# EAGLE design H0FR7 (EAGLE 9.6.1)

## Sheet 1 of 2
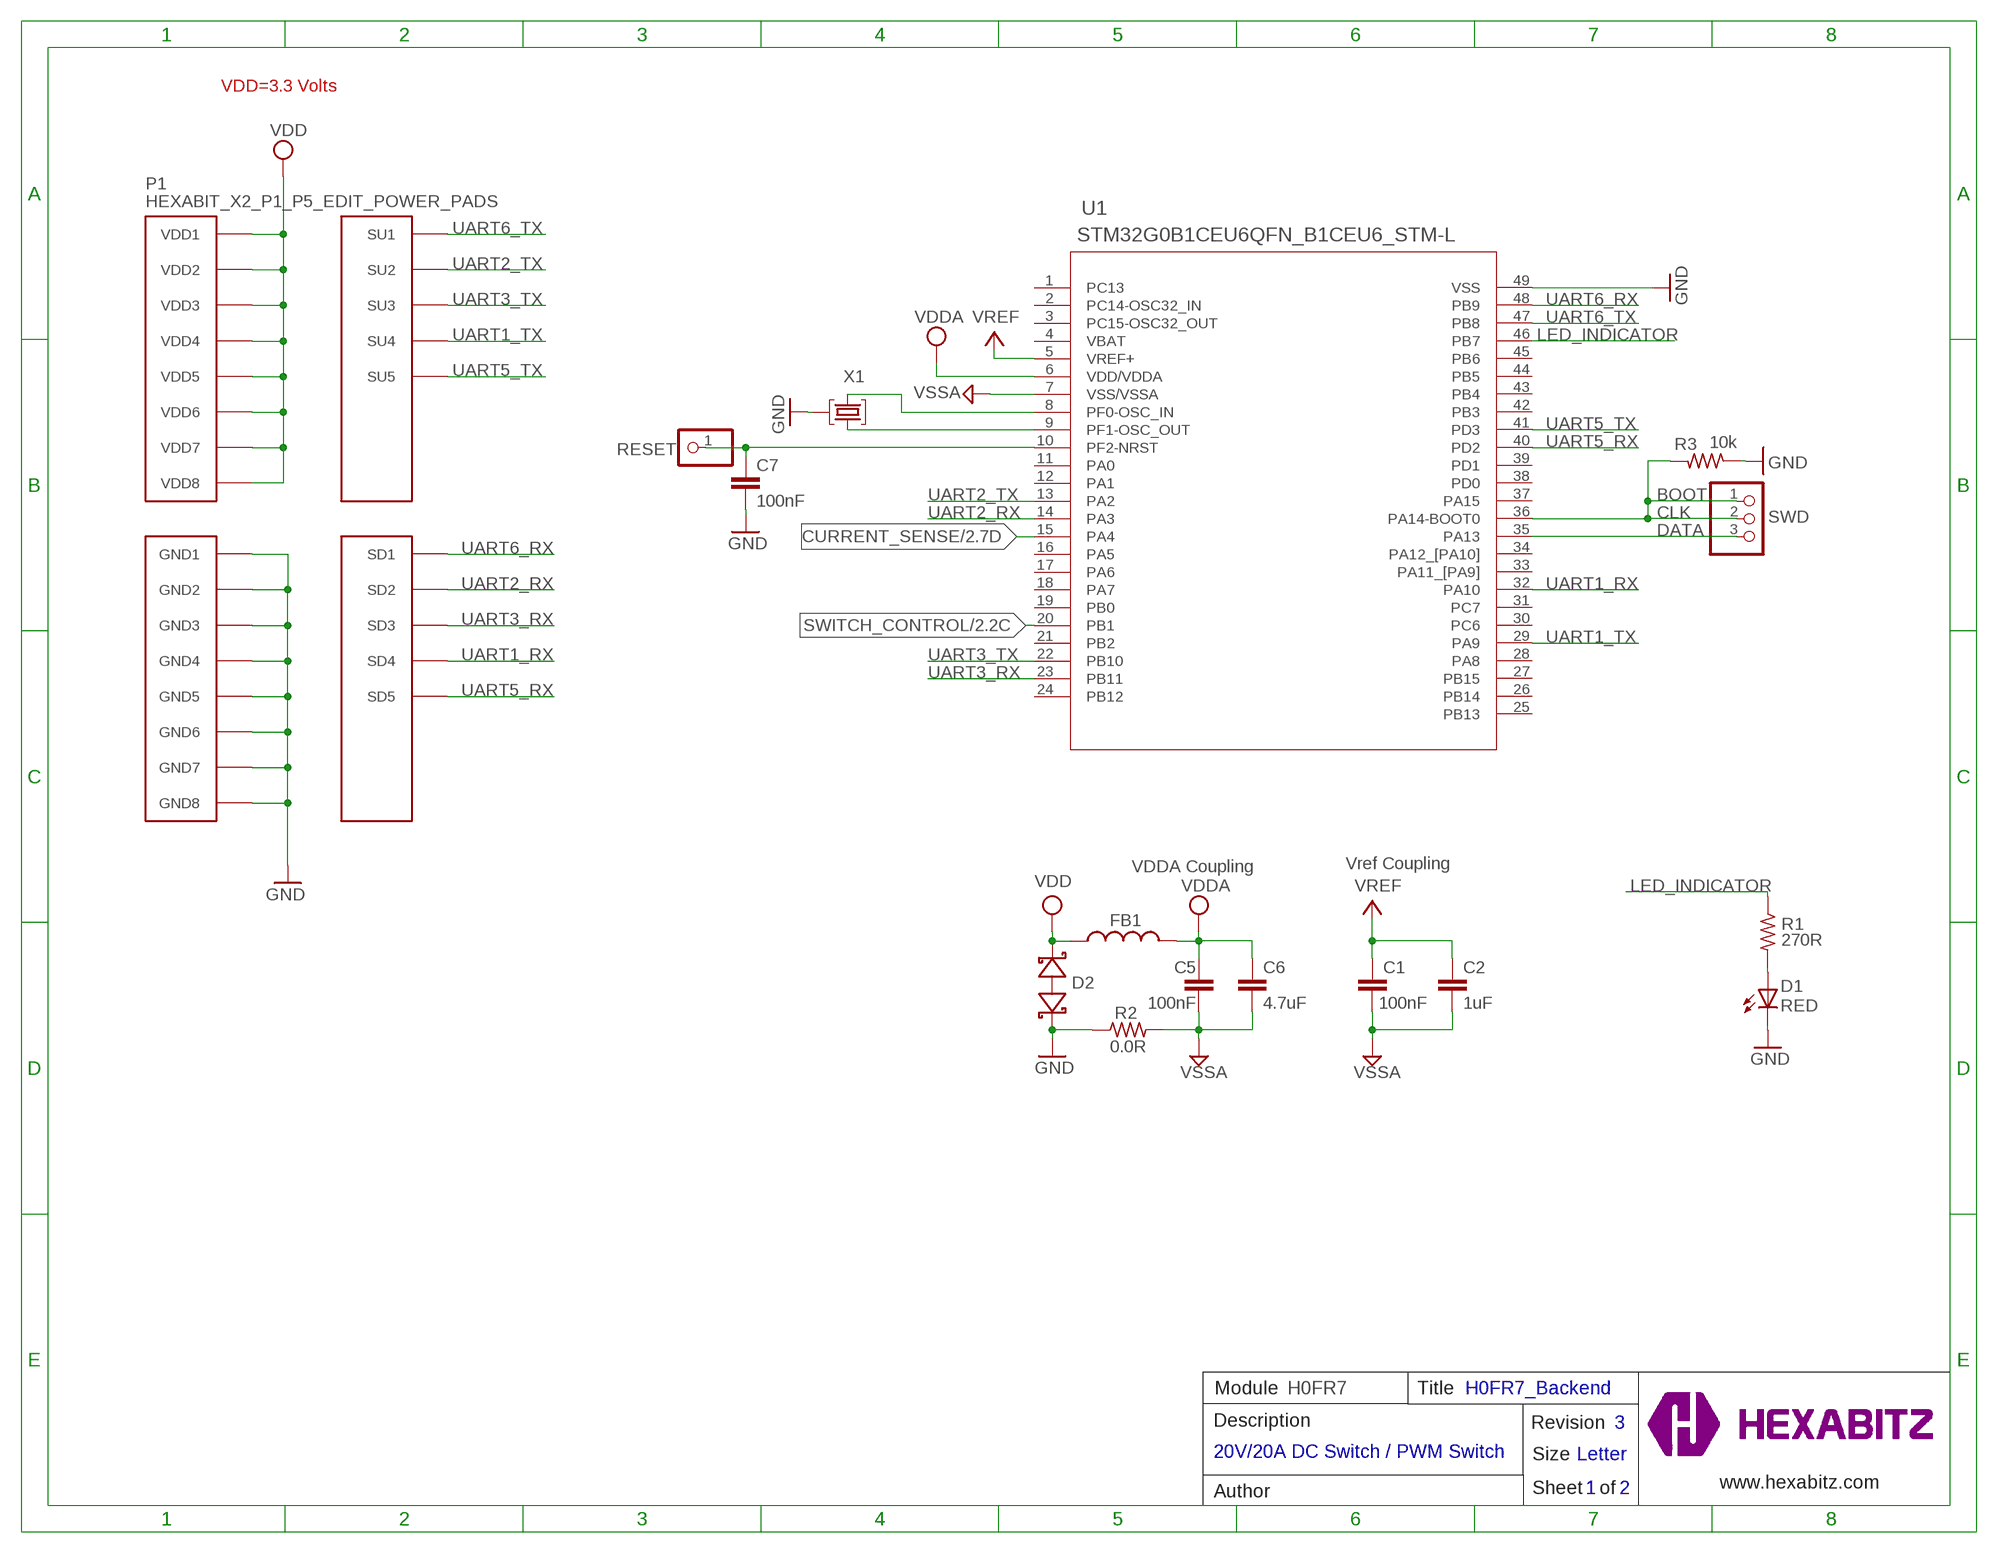
[diagram p0: schematic, sheet 1]

### Parts
C1  100nF  C-0603  [C-0603]
C2  1uF  C-0805  [C-0805]
C5  100nF  C-0603  [C-0603]
C6  4.7uF  C-0805  [C-0805]
C7  100nF  C-0603  [C-0603]
D1  RED  VLMS1300-GS08  [VLMS1300-GS08]
D2  BOURNS_CDSOD323-T03SCBOURNS_CDSOD323-T03SC_0_0  [BOURNS_CDSOD323-T03SC_0]
FB1  FB-0603  [FB-0603]
P1  HEXABIT_X2_P1_P5_EDIT_POWER_PADS  [HEXABIT_X2_P1_P5_EDIT_POWER_PADS]
R1  270R  R-0603  [R-0603]
R2  0.0R  R-0603  [R-0603]
R3  10k  R-0603  [R-0603]
RESET  R  PINHD-1X1  [1X01]
SWD  PINHD-1X3SWD  [SWD]
TRIMBLE-LOGO2  HEXA-LOGO  [HEXA-LOGO]
U1  STM32G0B1CEU6QFN_B1CEU6_STM-L  [QFN_B1CEU6_STM-L]
X1  XTALL_CSTCE8M00G52  [XTALL_CSTCE8M00G52]

### Nets
CLK: R3.2 SWD.1 SWD.2 U1.36(PA14-BOOT0)
CURRENT_SENSE: U1.15(PA4) ; also sheet 2
DATA: SWD.3 U1.35(PA13)
GND: C7.2 D1.C D2.2(C) P1.PAD_PD11(GND1) P1.PAD_PD12(GND2) P1.PAD_PD13(GND3) P1.PAD_PD14(GND4) P1.PAD_PD17(GND5) P1.PAD_PD18(GND6) P1.PAD_PD19(GND7) P1.PAD_PD20(GND8) R2.1 R3.1 U1.49(VSS) X1.P$2
LED_INDICATOR: R1.1 U1.46(PB7)
N$1: U1.9(PF1-OSC_OUT) X1.P$3
N$2: U1.8(PF0-OSC_IN) X1.P$1
N$4: D1.A R1.2
N$5: C7.1 RESET.1 U1.10(PF2-NRST)
SWITCH_CONTROL: U1.20(PB1) ; also sheet 2
UART1_RX: P1.PAD_PD4(SD4) U1.32(PA10)
UART1_TX: P1.PAD_PU4(SU4) U1.29(PA9)
UART2_RX: P1.PAD_PD2(SD2) U1.14(PA3)
UART2_TX: P1.PAD_PU2(SU2) U1.13(PA2)
UART3_RX: P1.PAD_PD3(SD3) U1.23(PB11)
UART3_TX: P1.PAD_PU3(SU3) U1.22(PB10)
UART5_RX: P1.PAD_PD5(SD5) U1.40(PD2)
UART5_TX: P1.PAD_PU5(SU5) U1.41(PD3)
UART6_RX: P1.PAD_PD1(SD1) U1.48(PB9)
UART6_TX: P1.PAD_PU1(SU1) U1.47(PB8)
VDD: D2.1(A) FB1.1 P1.PAD_PU11(VDD1) P1.PAD_PU12(VDD2) P1.PAD_PU13(VDD3) P1.PAD_PU14(VDD4) P1.PAD_PU17(VDD5) P1.PAD_PU18(VDD6) P1.PAD_PU19(VDD7) P1.PAD_PU20(VDD8)
VDDA: C5.1 C6.1 FB1.2 U1.6(VDD/VDDA) ; also sheet 2
VREF: C1.1 C2.1 U1.5(VREF+)
VSSA: C1.2 C2.2 C5.2 C6.2 R2.2 U1.7(VSS/VSSA) ; also sheet 2
Unconnected: U1.1(PC13) U1.2(PC14-OSC32_IN) U1.3(PC15-OSC32_OUT) U1.4(VBAT) U1.11(PA0) U1.12(PA1) U1.16(PA5) U1.17(PA6) U1.18(PA7) U1.19(PB0) U1.21(PB2) U1.24(PB12) U1.25(PB13) U1.26(PB14) U1.27(PB15) U1.28(PA8) U1.30(PC6) U1.31(PC7) U1.33(PA11_[PA9]) U1.34(PA12_[PA10]) U1.37(PA15) U1.38(PD0) U1.39(PD1) U1.42(PB3) U1.43(PB4) U1.44(PB5) U1.45(PB6)

### Notes on the sheet
- VDD=3.3 Volts
- BOOT
- VDDA Coupling | Vref Coupling
- Module | H0FR7 | Title | H0FR7_Backend
- Description | Revision | 3
- 20V/20A DC Switch / PWM Switch | Size | Letter
- www.hexabitz.com
- Author | Sheet   of | 1 | 2
- C:/Users/Admin/Desktop/logodraft.bmp

## Sheet 2 of 2
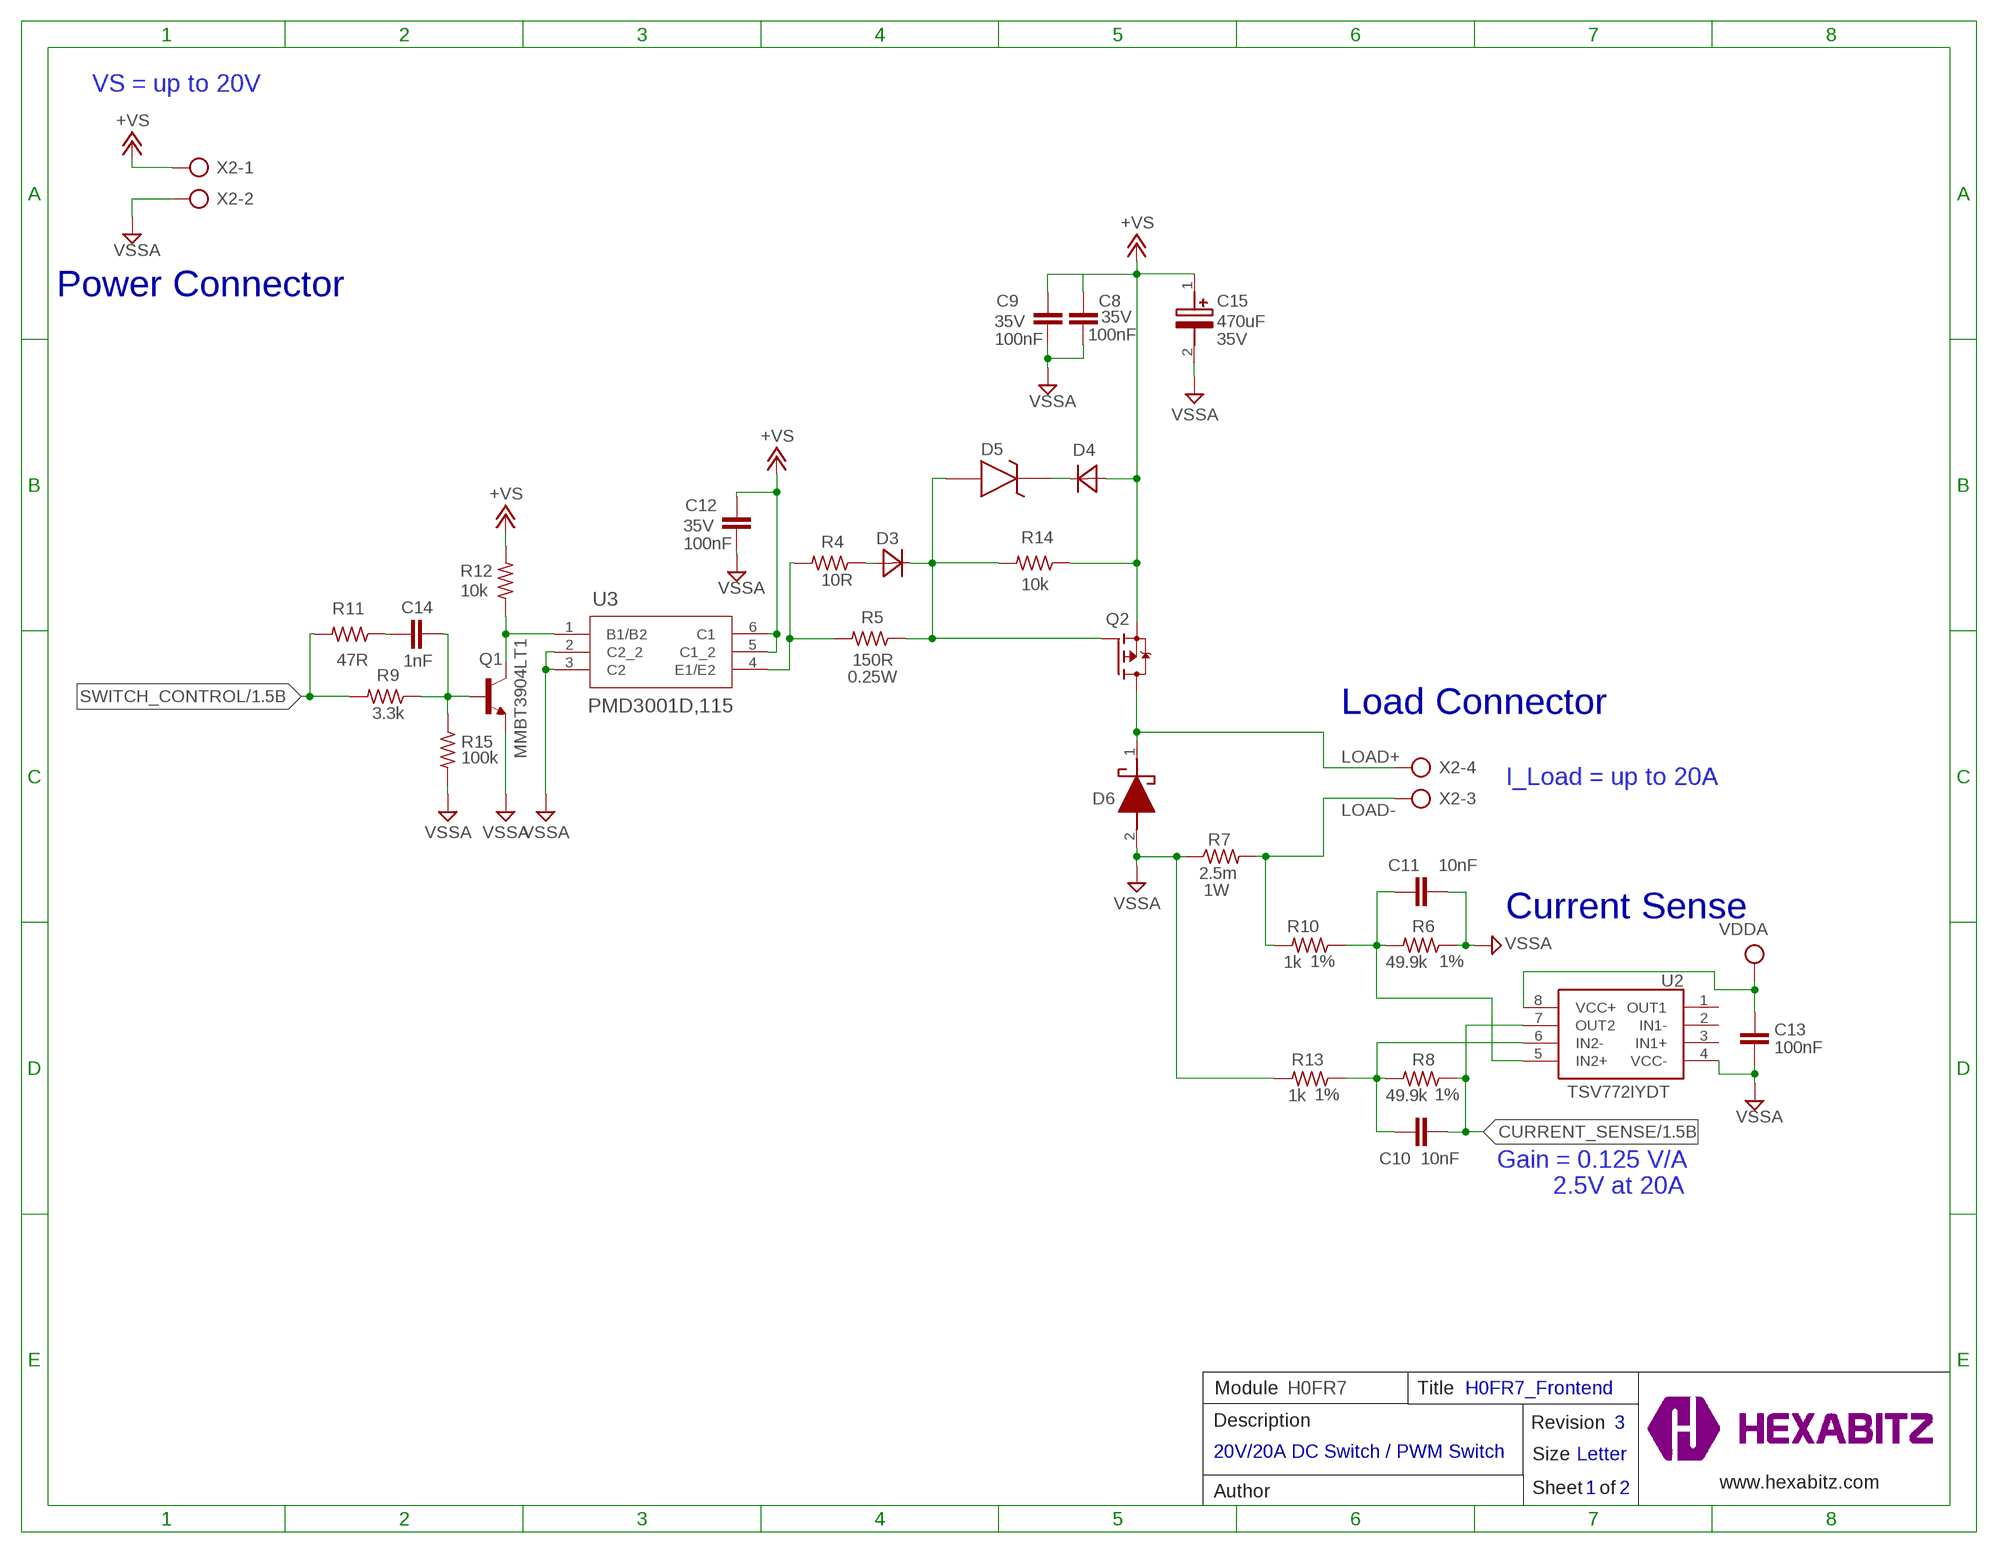
[diagram p1: schematic, sheet 2]

### Parts
C8  C-0603  [C-0603]
C9  C-0603  [C-0603]
C10  10nF  C-0603  [C-0603]
C11  10nF  C-0603  [C-0603]
C12  C-0603  [C-0603]
C13  100nF  C-0603  [C-0603]
C14  1nF  C-0603  [C-0603]
C15  ESH477M035AH3AA  [CAPPRD500W60D1000H1700]
D3  DIOD-SOD-123  [SOD123]
D4  DIOD-SOD-123  [SOD123]
D5  MMSZ4705T1GMMSZ4705T1G  [DIO_MMSZ4700T1G]
D6  V8PAM10S-M3_H  [V8PAM10SHM3H]
Q1  MMBT3904LT1  [MMBT3904LT1]
Q2  STD36P4LLF6  [DPAK-3]
R4  10R  R-0603  [R-0603]
R5  150R  R-0603  [R-0603]
R6  49.9k  R-0603  [R-0603]
R7  2.5m  R_1206R1206  [R1206]
R8  49.9k  R-0603  [R-0603]
R9  3.3k  R-0603  [R-0603]
R10  1k  R-0603  [R-0603]
R11  47R  R-0603  [R-0603]
R12  10k  R-0603  [R-0603]
R13  1k  R-0603  [R-0603]
R14  10k  R-0603  [R-0603]
R15  100k  R-0603  [R-0603]
U2  TSV772IYDT  [SOIC127P600X175-8N]
U3  PMD3001D,115  PMD3001DSOT457_NEX  [SOT457_NEX]
X2  AK300/4  [AK300/4]

### Nets
+VS: C8.2 C9.2 C12.2 C15.1(+) D4.1(A) Q2.3(S) R12.2 R14.1 U3.5(C1_2) U3.6(C1) X2.1
CURRENT_SENSE: C10.2 R8.1 U2.7(OUT2) ; also sheet 1
LOAD+: D6.1(K) Q2.4(D) X2.4
LOAD-: R7.2 R10.2 X2.3
N$3: Q1.3(C) R12.1 U3.1(B1/B2)
N$6: C11.1 R6.2 R10.1 U2.5(IN2+)
N$8: D4.2(C) D5.K
N$9: C10.1 R8.2 R13.1 U2.6(IN2-)
N$13: D3.1(A) R4.1
N$14: C14.2 Q1.1(B) R9.1 R15.1
N$15: C14.1 R11.1
N$16: R4.2 R5.2 U3.4(E1/E2)
N$19: D3.2(C) D5.A Q2.1(G) R5.1 R14.2
SWITCH_CONTROL: R9.2 R11.2 ; also sheet 1
VDDA: C13.2 U2.8(VCC+) ; also sheet 1
VSSA: C8.1 C9.1 C11.2 C12.1 C13.1 C15.2(-) D6.2(A) Q1.2(E) R6.1 R7.1 R13.2 R15.2 U2.4(VCC-) U3.2(C2_2) U3.3(C2) X2.2 ; also sheet 1
Unconnected: U2.1(OUT1) U2.2(IN1-) U2.3(IN1+)

### Notes on the sheet
- VS = up to 20V
- Power Connector
- Load Connector
- I_Load = up to 20A
- Current Sense
- Gain = 0.125 V/A
          2.5V at 20A
- Module | H0FR7 | Title | H0FR7_Frontend
- Description | Revision | 3
- 20V/20A DC Switch / PWM Switch | Size | Letter
- www.hexabitz.com
- Author | Sheet   of | 1 | 2

## Library data of the parts
C1 C7 C14 = HEXABITZ_RCLS:C-0603: CAP CER 10% X7R 0603; CAPACITANCE: 100nF; MFN: KEMET; MPN: C0603C104K8RACTU; OCTOPART_URL: https://octopart.com/c0603c104k8ractu-kemet-145075?r=sp&s=9bS9ASSwSEqMCE9KBEQZ0g; TOLERANCE: 10%; VOLTAGE_RATING: 10V
C2 C6 = HEXABITZ_RCLS:C-0805: CAP CER 10% X7R 0805
C5 = HEXABITZ_RCLS:C-0603: CAP CER 10% X7R 0603
C8 C9 C12 = HEXABITZ_RCLS:C-0603: CAP CER 10% X7R 0603; CAPACITANCE: 100nF; VOLTAGE_RATING: 35V
C10 C11 C13 = HEXABITZ_RCLS:C-0603: CAP CER 10% X7R 0603; CAPACITANCE: 100nF; MFN: KEMET; MPN: C0603C104K8RACTU; OCTOPART_URL: https://octopart.com/c0603c104k8ractu-kemet-145075?r=sp&s=9bS9ASSwSEqMCE9KBEQZ0g; TOLERANCE: 10V; VOLTAGE_RATING: 10%
C15 = HEXABITZ_RCLS:ESH477M035AH3AA: Kemet 470uF Electrolytic Aluminium Electrolytic Capacitor 35V dc Through Hole - ESH477M035AH3AA Source: Datasheet <https://www.arrow.com/en/products/esh477m035ah3aa/kemet-corporation>; CAPACITANCE: 470uF; DESCRIPTION: Kemet 470uF Electrolytic Aluminium Electrolytic Capacitor 35V dc Through Hole - ESH477M035AH3AA; HEIGHT: 17mm; MANUFACTURER_NAME: KEMET; MANUFACTURER_PART_NUMBER: ESH477M035AH3AA; MOUSER_PART_NUMBER: 80-ESH477M035AH3AA; MOUSER_PRICE-STOCK: https://www.mouser.co.uk/ProductDetail/KEMET/ESH477M035AH3AA?qs=w9hhVRgtvfm6jijrpCvP%2Fg%3D%3D; VOLT_RATING: 35V
D1 = Hexabitz:VLMS1300-GS08: Red 0603 130° Clear 54 mcd 2 V Surface Mount ChipLED ; Octopart Url : http://octopart.com/vlms1300-gs08-vishay-21709201; MFN: Vishay; MPN: VLMS1300-GS08; OCTOPART_URL: https://octopart.com/vlms1300-gs08-vishay-21709201?r=sp&s=_gcP4_q8T1SC6PJQPTQ9yA
D2 = HEXABITZ_RCLS:BOURNS_CDSOD323-T03SC: CDSOD323-TxxSC - TVS Diode Series; DESCRIPTION: Dio Tvs Vwm 03V 500W Bidir Sod323 / Tape & Reel - 7" Reel; MFN: Bourns; MPN: CDSOD323-T03SC; OCTOPART_URL: https://octopart.com/cdsod323-t03sc-bourns-10487153?r=sp
D3 D4 = HEXABITZ_RCLS:DIOD-SOD-123: 1.0 A Surface Mount Schottky Barrier Rectifier, 40 V, -65 to 125 degC, 2-Pin SOD-123 Package, RoHS, Tape and Reel; MPN: 1N4148W-7-F
D5 = HEXABITZ_RCLS:MMSZ4705T1G: 18 V Low Current ZenerDiodeVoltage Regulator Source: Datasheet <http://www.onsemi.com/pub/Collateral/MMSZ4678T1-D.PDF>; MPN: MMSZ4678T1G; VOLTAGE: 18V; WATT: 0.5w
D6 = HEXABITZ_RCLS:V8PAM10S-M3_H: Schottky Diodes & Rectifiers 8A 100V Source: Datasheet <https://www.vishay.com/docs/87013/v8pam10s.pdf>; DESCRIPTION: Schottky Diodes & Rectifiers 8A 100V; HEIGHT: 1mm; MANUFACTURER_NAME: Vishay; MANUFACTURER_PART_NUMBER: V8PAM10S-M3/H; MOUSER_PART_NUMBER: 78-V8PAM10S-M3/H; MOUSER_PRICE-STOCK: https://www.mouser.co.uk/ProductDetail/Vishay-General-Semiconductor/V8PAM10S-M3-H?qs=7MVldsJ5Uazp%2FkF6tV7Ktw%3D%3D
FB1 = HEXABITZ_RCLS:FB-0603: Ferrite Beads Multi-Layer 0603
P1 = hexabitz_connectors:HEXABIT_X2_P1_P5_EDIT_POWER_PADS
Q1 = HEXABITZ_RCLS:MMBT3904LT1: TRANS NPN 40V 0.2A SOT23; MOUNTING_STYLE: Surface Mount; NUM_OF_PINS: 3; PACKAGE: SOT-23-3; PACKAGING: Reel; PRODUCT_CATEGORY: Transistors Bipolar-BJT; SERIES: MMBT3904L
Q2 = HEXABITZ_RCLS:STD36P4LLF6: P-channel 40 V, 0.0175 Ω typ.,36 A, STripFET™ F6 Power MOSFET in a DPAK package; DISCRIPTION: P-channel 40 V, 0.0175 Ohm typ., 36 A STripFET F6 in a DPAK package; MFN: STMicroelectronics; MPN: STD36P4LLF6; OCTOPART_URL: https://octopart.com/std36p4llf6-stmicroelectronics-34425371?r=sp
R1 R2 = HEXABITZ_RCLS:R-0603: Thick Film Resistors - SMD 0603
R3 R12 = HEXABITZ_RCLS:R-0603: Thick Film Resistors - SMD 0603; MFN: Yageo; MPN: RC0603JR-0710KL; OCTOPART_URL: https://octopart.com/search?q=RC0603JR-0710KL&start=0; RESISTANCE: 10.0K Ohm; TOLERANCE: 5%
R4 R9 R11 R14 R15 = HEXABITZ_RCLS:R-0603: Thick Film Resistors - SMD 0603; MFN: Yageo; MPN: RC0603JR-07680KL; OCTOPART_URL: https://octopart.com/rc0603jr-07680kl-yageo-40953169?r=sp; RESISTANCE: 680K Ohm; TOLERANCE: 5%
R5 = HEXABITZ_RCLS:R-0603: Thick Film Resistors - SMD 0603; MPN: CRGP0603F150R; POWER: 0.25W
R6 R8 R10 R13 = HEXABITZ_RCLS:R-0603: Thick Film Resistors - SMD 0603; MFN: Yageo; MPN: RC0603JR-071KL; OCTOPART_URL: https://octopart.com/rc0603jr-071kl-yageo-55402888?r=sp; RESISTANCE: 1k; TOLERANCE: 1%
R7 = HEXABITZ_RCLS:R_1206: RESISTOR, American symbol; MFN: Stackpole Electronics; MPN: PA1206FRE472U5Z; POWER: 1W
RESET = HEXABITZ_USER_INTERFACE_PARTS:PINHD-1X1: PIN HEADER; MFN: TE Connectivity; MPN: 87227-1; OCTOPART_URL: https://octopart.com/87227-1-te+connectivity-39512052?r=sp
SWD = HEXABITZ_CONNECTION_PARTS:PINHD-1X3: PIN HEADER
TRIMBLE-LOGO2 = HEXABITZ_USER_INTERFACE_PARTS:HEXA-LOGO: Trimble-Logo
U1 = HEXABITZ_ICs:STM32G0B1CEU6; COPYRIGHT: Copyright (C) 2021 Ultra Librarian. All rights reserved.; MANUFACTURER_PART_NUMBER: STM32G0B1CEU6; MFR_NAME: STMicroelectronics
U2 = HEXABITZ_ICs:TSV772IYDT: High bandwidth (20MHz) Low offset (200 µV) rail-to-rail 5V Op amp Source: Datasheet <https://www.st.com/resource/en/datasheet/tsv772.pdf>; DESCRIPTION: High bandwidth (20MHz) Low offset (200 &#181;V) rail-to-rail 5V Op amp; HEIGHT: 1.75mm; MANUFACTURER_NAME: STMicroelectronics; MANUFACTURER_PART_NUMBER: TSV772IYDT
U3 = HEXABITZ_ICs:PMD3001D; COPYRIGHT: Copyright (C) 2022 Ultra Librarian. All rights reserved.; MANUFACTURER_PART_NUMBER: PMD3001D; MFR_NAME: Nexperia
X1 = HEXABITZ_OTHER_PARTS:XTALL_CSTCE8M00G52: MURATA CSTCE8M00G52-R0 RESONATOR, SMD, 8MHZ ; Octopart Url : https://octopart.com/cstce8m00g52-r0-murata-7145559; MFN: Murata; MPN: CSTCE8M00G52Z-R0; OCTOPART_URL: https://octopart.com/cstce8m00g52z-r0-murata-17755941?r=sp&s=JDnNJnrHQhyS8Zk4ofFWXw
X2 = HEXABITZ_CONNECTION_PARTS:AK300/4: CONNECTOR; OC_FARNELL: unknown; OC_NEWARK: unknown

## Board
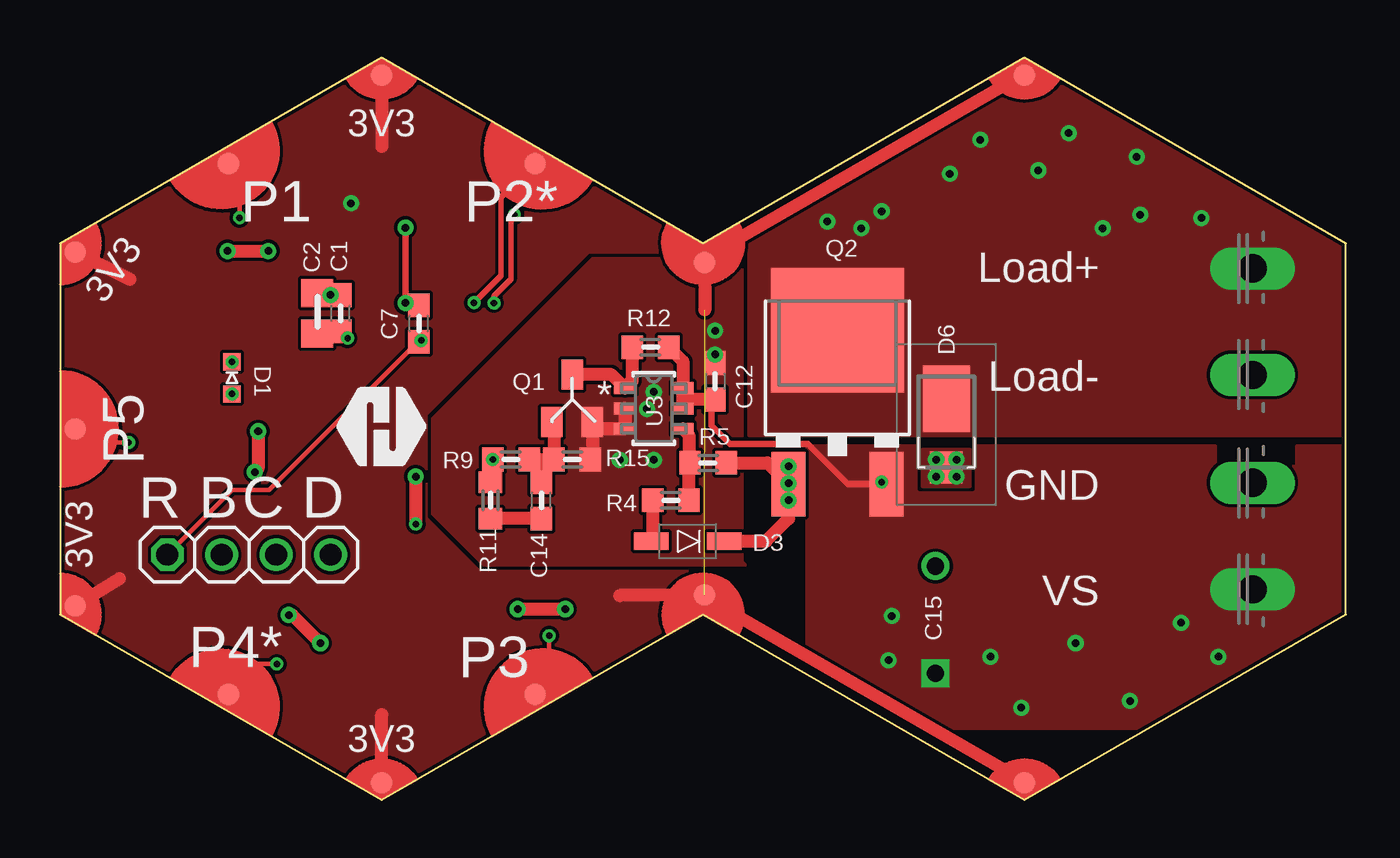
[diagram p2: board, top side]
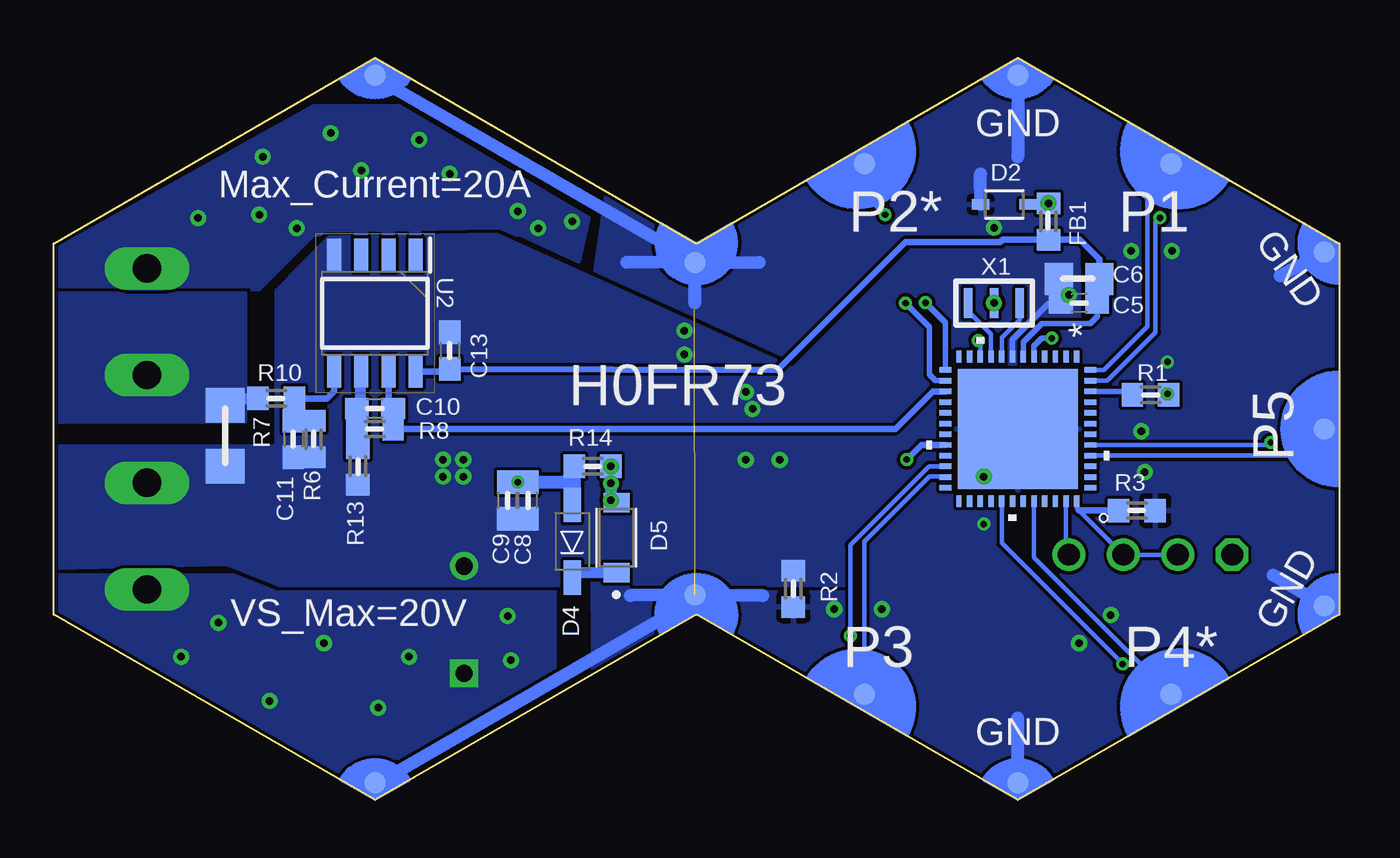
[diagram p3: board, bottom side, seen from below]

Size 60 x 34.64 mm. Coordinates in mm from the lower left corner, seen from the top.
Copper layers (1*16): Top 0.035mm / dielectric 1.5mm / Bottom 0.035mm
Design rules "default *": minimum track width 6mil, minimum drill 0.25mm, track to track 6mil, track to pad 6mil, pad to pad 6mil, via to via 6mil, smd to smd 0mil, copper to edge 0.15mm, drill to drill 6mil, minimum pad ring 10mil, minimum via ring 6mil, stop-mask expansion 4mil, vias tented up to drill 24mil, thermal gap 10mil

### Footprints (pad centres in the part's own frame; a part is rotated, then mirrored left to right if it is on the bottom)
C-0603 = smd 1.1 x 1: 1 -0.85,0; 2 0.85,0
C-0805 = smd 1.3 x 1.5: 1 -0.95,0; 2 0.95,0
CAPPRD500W60D1000H1700 = drill 0.8 pad 1.2 square: 1 -2.515,-0.127 | drill 0.8 pad 1.2: 2 2.485,-0.127
VLMS1300-GS08 = smd 0.8 x 0.8: A 0,0.75; C 0,-0.75
BOURNS_CDSOD323-T03SC_0 = smd 0.8 x 0.5: 1 -1.1,0; 2 1.1,0
SOD123 = smd 1.6 x 0.8: 1 -1.7,0; 2 1.7,0
DIO_MMSZ4700T1G = smd 0.915 x 1.22: A 1.637,0; K -1.637,0
V8PAM10SHM3H = smd 3.1 x 2.2: 1 -1.095,0 | smd 1.5 x 1.52: 2 2.125,0
FB-0603 = smd 1 x 1.1: 1 -0.85,0; 2 0.85,0
HEXABIT_X2_P1_P5_EDIT_POWER_PADS = smd 1 x 1 bottom: PAD_PD1 12.39,22.39; PAD_PD2 12.39,8.09; PAD_PD3 -12.39,8.09; PAD_PD4 -12.39,22.39; PAD_PD5 0,29.55; PAD_PD12 16.52,15.24; PAD_PD13 7.752,0.168; PAD_PD14 16.52,-14.76; PAD_PD17 -16.52,-14.76; PAD_PD18 -7.752,0.168; PAD_PD19 -16.52,15.24 | smd 1 x 1 rotated 60 bottom: PAD_PD11 8.26,29.547 | smd 1 x 1 rotated 120 bottom: PAD_PD20 -8.26,29.547 | smd 1 x 1: PAD_PU1 12.39,22.39; PAD_PU2 12.39,8.09; PAD_PU3 -12.39,8.09; PAD_PU4 -12.39,22.39; PAD_PU5 0,29.55; PAD_PU12 16.52,15.24; PAD_PU13 7.752,0.168; PAD_PU14 16.52,-14.76; PAD_PU17 -16.52,-14.76; PAD_PU18 -7.752,0.168; PAD_PU19 -16.52,15.24 | smd 1 x 1 rotated 60: PAD_PU11 8.26,29.547 | smd 1 x 1 rotated 120: PAD_PU20 -8.26,29.547
MMBT3904LT1 = smd 1 x 1.4: 1 -0.95,-1.1; 2 0.95,-1.1; 3 0,1.1
DPAK-3 = smd 1.6 x 3: 1 -2.286,-7.18; 3 2.286,-7.18 | smd 6.2 x 5.8: 4 0,0
R-0603 = smd 1 x 1.1: 1 -0.85,0; 2 0.85,0
R1206 = smd 1.6 x 1.803: 1 -1.422,0; 2 1.422,0
1X01 = drill 1.016 octagon: 1 0,0
SWD = drill 1.016: 1 -2.54,0; 2 0,0; 3 2.54,0
QFN_B1CEU6_STM-L = smd 0.55 x 0.254: 1 -3.38,2.751; 2 -3.38,2.251; 3 -3.38,1.75; 4 -3.38,1.25; 5 -3.38,0.75; 6 -3.38,0.25; 7 -3.38,-0.25; 8 -3.38,-0.75; 9 -3.38,-1.25; 10 -3.38,-1.75; 11 -3.38,-2.251; 12 -3.38,-2.751; 25 3.38,-2.751; 26 3.38,-2.251; 27 3.38,-1.75; 28 3.38,-1.25; 29 3.38,-0.75; 30 3.38,-0.25; 31 3.38,0.25; 32 3.38,0.75; 33 3.38,1.25; 34 3.38,1.75; 35 3.38,2.251; 36 3.38,2.751 | smd 0.254 x 0.55: 13 -2.751,-3.38; 14 -2.251,-3.38; 15 -1.75,-3.38; 16 -1.25,-3.38; 17 -0.75,-3.38; 18 -0.25,-3.38; 19 0.25,-3.38; 20 0.75,-3.38; 21 1.25,-3.38; 22 1.75,-3.38; 23 2.251,-3.38; 24 2.751,-3.38; 37 2.751,3.38; 38 2.251,3.38; 39 1.75,3.38; 40 1.25,3.38; 41 0.75,3.38; 42 0.25,3.38; 43 -0.25,3.38; 44 -0.75,3.38; 45 -1.25,3.38; 46 -1.75,3.38; 47 -2.251,3.38; 48 -2.751,3.38 | smd 5.6 x 5.6: 49 0,0
SOIC127P600X175-8N = smd 1.528 x 0.65: 1 -2.711,1.905; 2 -2.711,0.635; 3 -2.711,-0.635; 4 -2.711,-1.905; 5 2.711,-1.905; 6 2.711,-0.635; 7 2.711,0.635; 8 2.711,1.905
SOT457_NEX = smd 1.003 x 0.55: 1 -1.353,0.95; 2 -1.353,0; 3 -1.353,-0.95; 4 1.353,-0.95; 5 1.353,0; 6 1.353,0.95
XTALL_CSTCE8M00G52 = smd 1.4 x 0.4: P$1 0,1.2; P$2 0,0; P$3 0,-1.2
AK300/4 = drill 1.321 long: 1 -7.493,0; 2 -2.515,0; 3 2.515,0; 4 7.493,0

### Placement (x,y rotation side)
C1  13.09,22.72 90 top
C2  11.98,22.72 90 top
C5  12.14,23.19 180 bottom
C6  12.14,24.3 180 bottom
C7  16.75,22.24 90 top
C8  37.86,13.99 90 bottom
C9  38.81,13.99 90 bottom
C10  45,18.27 0 bottom
C11  48.81,16.84 270 bottom
C12  30.56,19.54 270 top
C13  41.51,20.97 270 bottom
C14  22.46,13.99 90 top
C15  40.72,8.43 90 top
D1  8.01,19.7 180 top
D2  15.63,27.8 180 bottom
D3  29.29,12.08 0 top
D4  35.8,12.08 270 bottom
D5  33.73,12.24 90 bottom
D6  41.35,17.64 270 top
FB1  13.57,27 270 bottom
P1  30.24,17.32 90 top
Q1  23.89,18.75 0 top
Q2  36.27,21.92 0 top
R1  8.81,18.91 0 bottom
R2  25.48,9.86 90 bottom
R3  9.44,13.51 180 bottom
R4  28.49,13.99 0 top
R5  30.24,15.73 180 top
R6  47.86,16.84 90 bottom
R7  51.99,17 90 bottom
R8  45,17.32 180 bottom
R9  21.03,15.89 180 top
R10  49.61,18.75 180 bottom
R11  20.08,13.99 90 top
R12  27.54,21.13 0 top
R13  45.8,15.57 270 bottom
R14  34.84,15.57 0 bottom
R15  23.89,15.89 0 top
RESET  5,11.45 90 top
SWD  10.08,11.45 0 top
TRIMBLE-LOGO2  15,15.57 0 top
U1  15,17.32 270 bottom
U2  45,22.72 270 bottom
U3  27.7,18.27 0 top
X1  16.11,23.19 270 bottom
X2  55.64,17.32 90 top

### Tracks (layer width: path | path; a pad name or v marks a point on that pad's centre or on a via)
+VS  (via drill 0.3 pad 0.6, 0.35 pad 0.75)
  Top 0.305: Q2.3 36.77,14.74 34.89,16.63 31.25,16.63 30.4,17.48 30.4,18.53 C12.2
  Top 0.61: U3.5 29.05,18.75 | 29.05,18.75 U3.6 29.05,20.47 R12.2 | C12.2 29.11,18.69 29.05,18.75
  Bottom 0.508: C9.2 v38.34,14.84
  Bottom 0.61: D4.1 35.69,13.88 35.69,14.94 | 35.69,14.94 R14.1 | v38.34,14.84 C8.2 35.8,14.84 35.69,14.94
  other vias: 54.05,6.68 49.92,4.62 44.84,4.3 43.42,6.68 47.38,7.32 52.31,8.27 38.81,8.59 38.65,6.53
  pour Top (rank 2, no thermals): 34.84,16.53 34.84,3.35 59.93,3.35 59.93,16.53 57.7,16.53 57.7,15.57 53.89,15.57 53.89,16.53
  pour Bottom (rank 3, no thermals): 59.93,10.49 36.59,10.49 36.59,4.78 45,0.02 59.93,8.59
CLK
  Bottom 0.203: U1.36 12.25,13.62 12.14,13.51 SWD.2 SWD.1
  Bottom 0.305: R3.2 12.14,13.51
CURRENT_SENSE
  Bottom 0.305: U2.7 44.37,18.49 C10.2 R8.1 20.72,17.32 18.96,19.07 U1.15
DATA
  Bottom 0.203: U1.35 12.75,11.58 SWD.3
GND  (via drill 0.3 pad 0.6, 0.35 pad 0.75)
  Top 0.254: C7.2 16.21,23.09 X1.P$2
  Top 0.305: X1.P$2 v16.11,26.71
  Top 0.61: v23.57,8.91 v21.35,8.91 | v12.14,7.32 10.83,8.64 v10.67,8.64 | v9.24,17.21 9.24,15.46 v9.08,15.3 | v7.81,25.62 v9.71,25.62 | v16.59,15.1 v16.59,12.87
  Bottom 0.254: D1.C 8.02,20.49
  Bottom 0.61: P1.PAD_PD17 44.86,0.8 31.06,8.77 30.15,9.01 30.09,9.07 29.91,9.07 29.9,9.06 29.76,9.06 | P1.PAD_PD14 44.81,33.65 31.57,26.01 30.15,25.63 30.09,25.57 29.94,25.57 29.92,25.57 | U1.49 16.59,15.73 v16.59,15.1 | P1.PAD_PD11 2.78,24.46 | P1.PAD_PD20 3.09,10.49 | P1.PAD_PD19 15,3.83 | 26.91,9.54 P1.PAD_PD18 33.1,9.54 | P1.PAD_PD13 30.08,23.19 | P1.PAD_PD13 27.07,25.1 | P1.PAD_PD13 33.26,25.1 | P1.PAD_PD12 15,30.02 | D2.2 16.75,29.23
  other vias: 16.11,23.19 8.01,20.45
  pour Bottom (rank 2): 34.88,11.4 34.84,6.05 29.92,8.75 14.98,0.03 0.08,8.75 0.08,25.89 15.01,34.63 29.92,25.89 34.21,28.27 34.99,23.07
LED_INDICATOR
  Bottom 0.254: U1.46 9.82,19.07 R1.1
LOAD+  (via drill 0.35 pad 0.75)
  other vias: 38.34,27.48 37.38,26.69 35.8,27 41.51,29.23 42.94,30.81 45.64,29.39 47.07,31.13 48.66,26.69 50.4,27.32 53.26,27.16 50.24,30.02
  pour Top (rank 2, no thermals): 60.56,33.99 60.56,17 32.14,17 32.14,28.27 38.81,34.94 59.61,34.94
  pour Bottom (rank 3, no thermals): 59.77,23.83 50.4,23.83 47.86,26.37 38.2,26.37 35.48,25.1 35,27.16 43.89,32.4 47.86,32.4 59.77,25.8
LOAD-
  Bottom 0.508: R7.2 51.66,18.75 R10.2
  pour Bottom (no thermals): 59.93,17.64 51.04,17.64 51.04,23.67 59.93,23.67
N$1
  Bottom 0.203: X1.P$3 17.31,22.81 16.25,21.75 U1.9
N$2
  Bottom 0.203: X1.P$1 14.91,22.43 15.75,21.59 U1.8
N$3
  Top 0.61: R12.1 26.69,19.57 U3.1 25.72,19.85 Q1.3
N$4  (via drill 0.3 pad 0.6)
  Bottom 0.254: D1.A R1.2
  other vias: 8.01,18.95
N$5  (via drill 0.3 pad 0.6)
  Top 0.203: v16.85,21.45 16.75,21.45 9.76,14.46 8.02,14.46 RESET.1
  Top 0.508: C7.1 16.8,21.45 v16.85,21.45
  Bottom 0.203: v16.85,21.45 16.75,21.35 U1.10
N$6
  Bottom 0.305: R10.1 47.23,18.75 46.91,19.07 U2.5
  Bottom 0.508: R10.1 48.76,17.75 C11.1 R6.2
N$8
  Bottom 0.508: D5.K 35.58,10.6 35.69,10.49
  Bottom 0.61: 35.69,10.49 D4.2
N$9
  Bottom 0.508: U2.6 45.7,19.95 45.7,18.43 C10.1 R8.2 45.85,16.48 R13.1
N$13
  Top 0.61: R4.1 27.64,12.14 D3.1
N$14
  Top 0.61: Q1.1 23.04,17.55 R15.1 | R9.1 R15.1 | R15.1 22.46,15.31 C14.2
N$15
  Top 0.61: C14.1 R11.1
N$16
  Top 0.61: R4.2 29.34,15.69 | 29.34,15.69 R5.2 | U3.4 29.34,17.03 29.34,15.69
N$19  (via drill 0.35 pad 0.75)
  Top 0.508: Q2.1 33.99,15.57 R14.2
  Top 0.61: R5.1 33,15.73 Q2.1 33.99,13.13 32.94,12.08 D3.2
  Bottom 0.508: R14.2 v33.99,14.78 | v33.99,14.78 v33.99,13.99 33.84,13.99 D5.A | 33.99,14.05 v33.99,14.78
  Bottom 0.61: 34.05,15.52 R14.2
  other vias: 33.99,15.57
SWITCH_CONTROL  (via drill 0.3 pad 0.6)
  Top 0.61: R11.2 20.18,14.94 R9.2
  Bottom 0.254: R9.2 20,16.07
  Bottom 0.305: R9.2 19.5,16.57 U1.20
  other vias: 20.18,15.89
UART1_RX
  Bottom 0.203: U1.32 14.25,11.33 P1.PAD_PD4
UART1_TX  (via drill 0.3 pad 0.6)
  Top 0.203: v10.1,6.34 9.26,6.34 P1.PAD_PU4
  Bottom 0.203: U1.29 15.75,11.99 v10.1,6.34
UART2_RX  (via drill 0.3 pad 0.6)
  Top 0.254: v21.19,27.32 21.03,27.16 21.03,24.3 20.24,23.51 v20.24,23.19
  Bottom 0.254: v21.19,27.32 22.15,28.28 P1.PAD_PD2 | v20.24,23.19 19.13,22.08 19.13,19.86 18.84,19.57 U1.14
UART2_TX  (via drill 0.3 pad 0.6)
  Top 0.254: v19.31,23.21 20.58,24.48 20.58,28.13 P1.PAD_PU2
  Bottom 0.254: U1.13 18.38,22.29 v19.31,23.21
UART3_RX
  Bottom 0.203: P1.PAD_PD3 22.15,12.07 19.13,15.1 18.41,15.1 U1.23
UART3_TX  (via drill 0.3 pad 0.6)
  Top 0.203: v22.82,7.66 22.82,5.6 P1.PAD_PU3
  Bottom 0.203: U1.22 19.16,15.57 22.82,11.91 v22.82,7.66
UART5_RX
  Bottom 0.203: U1.40 1.94,16.07 P1.PAD_PD5
UART5_TX  (via drill 0.3 pad 0.6)
  Top 0.203: v3.2,16.68 1.33,16.68 P1.PAD_PU5
  Bottom 0.203: U1.41 3.31,16.57 v3.2,16.68
UART6_RX
  Bottom 0.203: U1.48 10.99,20.07 8.97,22.09 8.97,28.59 P1.PAD_PD1
UART6_TX  (via drill 0.3 pad 0.6)
  Top 0.203: v8.37,27.18 8.37,29.19 P1.PAD_PU1
  Bottom 0.203: v8.37,27.18 8.57,26.97 8.57,21.83 10.83,19.57 U1.47
VDD  (via drill 0.35 pad 0.75)  (1 unrouted)
  Top 0.508: 30.83,9.02 30.89,8.95 30.69,8.95
  Top 0.61: P1.PAD_PU14 44.85,33.84 31.38,26.06 30.39,25.07 P1.PAD_PU13 30.08,22.88 | 30.69,8.95 P1.PAD_PU18 26.11,9.54 | P1.PAD_PU17 44.92,0.88 30.83,9.02 | P1.PAD_PU19 15,3.98 | P1.PAD_PU20 2.78,10.33 | P1.PAD_PU11 3.25,24.3 | P1.PAD_PU12 15,30.5
  Bottom 0.305: D2.1 13.63,27.8 FB1.1
  other vias: 13.57,27.85
  pour Top (rank 2): 30.08,34.62 30.08,5.89 23.25,-0.94 4.52,-0.94 -4.21,7.8 -4.21,30.34 0.08,34.62
VDDA
  Bottom 0.254: U1.6 14.75,21.37 13.87,22.24 11.61,22.24 11.29,22.56 C5.1 11.19,23.29 C6.1
  Bottom 0.305: U2.8 41.94,20.01 C13.2 26.21,20.07 20.25,26.03 15.83,26.03 15.71,26.15 FB1.2 12.1,26.15 11.19,25.24 C6.1
VREF  (via drill 0.3 pad 0.6)
  Top 0.305: C2.1 13.2,21.77 v13.41,21.55 C1.1
  Bottom 0.254: v13.41,21.55 13.89,21.55 14.25,21.19 U1.5
VSSA  (via drill 0.35 pad 0.75)
  Top 0.305: C1.2 v12.62,23.57 12.52,23.67 C2.2
  Top 0.61: R15.2 24.84,15.99 Q1.2 25.17,17.32 U3.3 U3.2 | C12.1 v30.56,20.79
  Bottom 0.254: U1.7 15.25,21.5 13.55,23.19 C5.2 13.09,23.29 C6.2
  other vias: 41.83,15.89 40.88,15.89 40.88,15.1 41.83,15.1 27.38,18.25 27.7,19.05 26.11,15.87 27.7,15.87 30.56,21.9
  pour Bottom (no thermals): 59.93,16.53 59.93,10.81 51.91,10.99 49.45,10.02 21.11,10.02 21.11,12.48 19.44,14.15 12.03,13.81 12.15,26.05 19.6,26.05 25.49,20.17 39.35,26.42 47.17,26.26 49.61,23.78 49.61,16.53
  pour Top (no thermals): 40.24,16.37 40.24,14.62 42.46,14.62 42.46,16.37
  pour Top (no thermals): 31.83,24.78 31.83,11.13 31.99,10.97 19.76,10.97 17.38,13.35 17.38,17.8 24.84,25.26 31.35,25.26

### Text on the board
tPlace: 3V3 | P1 | P2* | Load+ | 3V3 | Load- | P5 | GND | 3V3 | VS | P4* | P3 | 3V3
bPlace: GND | Max_Current=20A | P1 | P2* | GND | H0FR73 | P5 | GND | VS_Max=20V | P4* | P3 | GND
tNames: R | B | C | D